# EAGLE design ADXL362WakeOnShake (EAGLE 6.5.0)
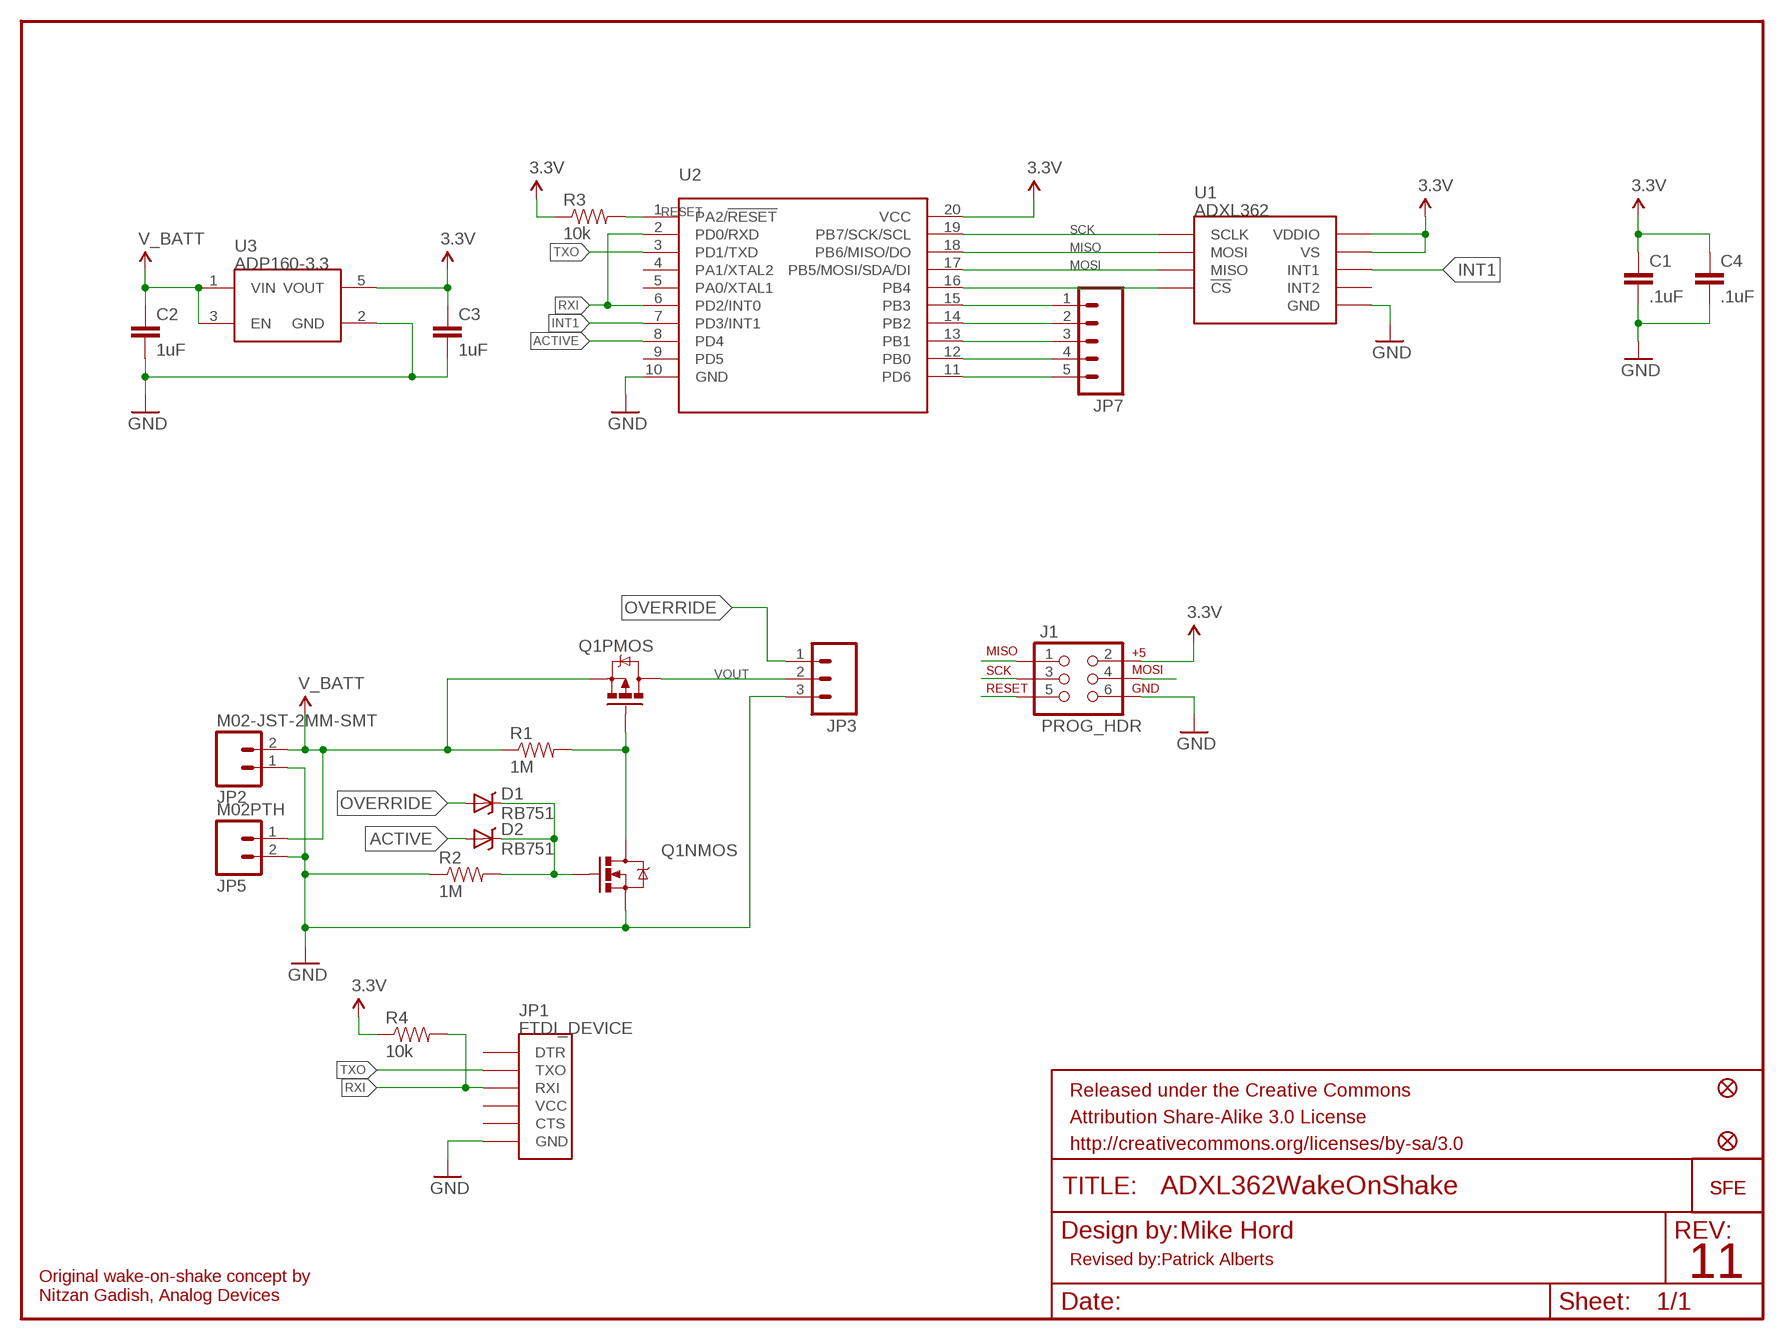
[diagram p0: schematic, sheet 1]

## Parts
C1  .1uF  0.1UF-25V(+80/-20%)(0603)  [0603-CAP]
C2  1uF  1.0UF-16V-10%(0603)  [0603-CAP]
C3  1uF  1.0UF-16V-10%(0603)  [0603-CAP]
C4  .1uF  0.1UF-25V(+80/-20%)(0603)  [0603-CAP]
D1  RB751  [SOD-523]
D2  RB751  DIODE-SCHOTTKY  [SOD-523]
FID1  FIDUCIAL1X2  [FIDUCIAL-1X2]
FID2  FIDUCIAL1X2  [FIDUCIAL-1X2]
FRAME1  FRAME-LETTER  [CREATIVE_COMMONS]
J1  PROG_HDR  AVR_SPI_PRG_6PTH  [2X3]
JP1  FTDI_DEVICE  [FTDI_DEVICE_SIDE]
JP2  M02-JST-2MM-SMT  [JST-2-SMD]
JP3  M03PTH  [1X03]
JP4  LOGO-SFENW2  [SFE-NEW-WEB]
JP5  M02PTH  [1X02]
JP6  LOGO-SFENEW  [SFE-NEW-WEBLOGO]
JP7  M05PTH  [1X05]
Q1  IRF7509  [MSOP8]
R1  1M  1MOHM1/10W1%(0603)  [0603-RES]
R2  1M  1MOHM1/10W1%(0603)  [0603-RES]
R3  10k  10K-1%RES-00824  [0603-RES]
R4  10k  10K-1%RES-00824  [0603-RES]
U1  ADXL362  ADXL362ADXL362-1:1  [ADXL362-1:1]
U2  ATTINY2313A  [SOP20W]
U3  ADP160-3.3  ADP160  [SOT23-5]

## Nets
3.3V: C1.1 C3.1 C4.1 J1.2 R3.1 R4.1 U1.P$1(VDDIO) U1.P$14(VS) U2.20(VCC) U3.5(VOUT)
ACTIVE: D2.A U2.8(PD4)
GND: C1.2 C2.2 C3.2 C4.2 J1.6 JP1.P$6(GND) JP2.1 JP3.3 JP5.2 Q1.1(NMOS:S) R2.1 U1.P$12(GND) U1.P$13(GND) U1.P$16(GND) U2.10(GND) U3.2(GND)
INT1: U1.P$11(INT1) U2.7(PD3/INT1)
MISO: J1.1 U1.P$6(MOSI) U2.18(PB6/MISO/DO)
MOSI: J1.4 U1.P$7(MISO) U2.17(PB5/MOSI/SDA/DI)
N$1: Q1.4(PMOS:G) Q1.7(NMOS:D) Q1.8(NMOS:D) R1.2
N$2: D1.C D2.C Q1.2(NMOS:G) R2.2
N$3: JP7.1 U2.15(PB3)
N$4: JP7.2 U2.14(PB2)
N$5: JP7.3 U2.13(PB1)
N$6: JP7.4 U2.12(PB0)
N$7: U1.P$8(!CS) U2.16(PB4)
N$8: JP7.5 U2.11(PD6)
OVERRIDE: D1.A JP3.1
RESET: J1.5 R3.2 U2.1(PA2/!RESET)
RXI: JP1.P$3(RXI) R4.2 U2.2(PD0/RXD) U2.6(PD2/INT0)
SCK: J1.3 U1.P$4(SCLK) U2.19(PB7/SCK/SCL)
TXO: JP1.P$2(TXO) U2.3(PD1/TXD)
V_BATT: C2.1 JP2.2 JP5.1 Q1.3(PMOS:S) R1.1 U3.1(VIN) U3.3(EN)
VOUT: JP3.2 Q1.5(PMOS:D) Q1.6(PMOS:D)
Unconnected: JP1.P$1(DTR) JP1.P$4(VCC) JP1.P$5(CTS) U1.P$9(INT2) U2.4(PA1/XTAL2) U2.5(PA0/XTAL1) U2.9(PD5)

## Notes on the sheet
- Mike Hord
- Revised by:Patrick Alberts
- 11
- Original wake-on-shake concept by
  Nitzan Gadish, Analog Devices

## Library data of the parts
C1 C4 = SparkFun-Capacitors:0.1UF-25V(+80/-20%)(0603): CAP-00810 Ceramic Standard decoupling cap; PROD_ID: CAP-00810; VALUE: 0.1uF
C2 C3 = SparkFun-Capacitors:1.0UF-16V-10%(0603): CAP-00868; PROD_ID: CAP-00868; VALUE: 1.0uF
D1 = SparkFun-DiscreteSemi:RB751: 40V 120mA SOD-523 Schottky DIO-11018; PROD_ID: DIO-11018
D2 = SparkFun-DiscreteSemi:DIODE-SCHOTTKY: Commonly MBRA140.; PROD_ID: DIO-11018
FID1 FID2 = SparkFun-Aesthetics:FIDUCIAL: Fiducial Alignment Points Various fiducial points for machine vision alignment.
FRAME1 = SparkFun-Aesthetics:FRAME-LETTER: Schematic Frame Standard 8.5x11 US Letter frame
J1 = SparkFun-Connectors:AVR_SPI_PRG_6: AVR ISP 6 Pin This is the reduced ISP connector for AVR programming. Common on Arduino. This footprint will take up less PCB space and can be used with a 10-pin to 6-pin adapter such as SKU: BOB-08508
JP1 = SparkFun-Connectors:FTDI_DEVICE: Connector which mates to FTDI basic or FTDI cable.
JP2 = SparkFun-Connectors:M02: Standard 2-pin 0.1" header. Use with - straight break away headers ( PRT-00116) - right angle break away headers (PRT-00553) - swiss pins (PRT-00743) - machine pins (PRT-00117) - female headers (PRT-00115) Molex polarized connector foot print use with: PRT-08233 with associated crimp pins and housings. 2.54_SCREWTERM for use with PRT-10571. 3.5mm Screw Terminal footprints for PRT-08084 5mm Screw Terminal footprints for use with PRT-08433; PROD_ID: CONN-08352
JP3 = SparkFun-Connectors:M03: Header 3 Standard 3-pin 0.1" header. Use with straight break away headers (SKU : PRT-00116), right angle break away headers (PRT-00553), swiss pins (PRT-00743), machine pins (PRT-00117), and female headers (PRT-00115). Molex polarized connector foot print use with SKU : PRT-08232 with associated crimp pins and housings.
JP4 JP6 = SparkFun-Aesthetics:LOGO-SFE: Spark Fun Electronics PCB Logo This is the standard Spark Fun Electronics PCB logo.
JP5 = SparkFun-Connectors:M02: Standard 2-pin 0.1" header. Use with - straight break away headers ( PRT-00116) - right angle break away headers (PRT-00553) - swiss pins (PRT-00743) - machine pins (PRT-00117) - female headers (PRT-00115) Molex polarized connector foot print use with: PRT-08233 with associated crimp pins and housings. 2.54_SCREWTERM for use with PRT-10571. 3.5mm Screw Terminal footprints for PRT-08084 5mm Screw Terminal footprints for use with PRT-08433
JP7 = SparkFun-Connectors:M05: Header 5 Standard 5-pin 0.1" header. Use with straight break away headers (SKU : PRT-00116), right angle break away headers (PRT-00553), swiss pins (PRT-00743), machine pins (PRT-00117), and female headers (PRT-00115). Molex polarized connector foot print use with SKU : PRT-08230 with associated crimp pins and housings.
Q1 = SparkFun-DiscreteSemi:IRF7509: 30V Dual PMOS/NMOS MSOP-8 NMOS RDS .11-ohm PMOS RDS .20-ohm; PROD_ID: TRANS-07913
R1 R2 = SparkFun-Resistors:1MOHM1/10W1%(0603): RES-07868; PROD_ID: RES-07868
R3 R4 = SparkFun-Resistors:10K-1%: 10k-ohm SMT 1/10W - 1% (0603) RES-00824; PROD_ID: RES-00824
U1 = SparkFun-Sensors:ADXL362: Micropower 3-axis accelerometer 2/4/8g digital output (SPI) IC-11297
U2 = SparkFun-DigitalIC:ATTINY2313A: ATTINY2313A 2kB 20MHz I2C/SPI/UART; DIST: DIGIKEY; DIST_ID: ATTINY2313A-SU-ND; PROD_ID: IC-11305; VALUE: ATTINY2313A
U3 = SparkFun-PowerIC:ADP160: Nanopower LDO Iq less than 1uA for low Iload; DIST: Digikey; DIST_ID: ADP160AUJZ-3.3-R7TR-ND; PROD_ID: VREG-11306; VALUE: ADP160

## Board
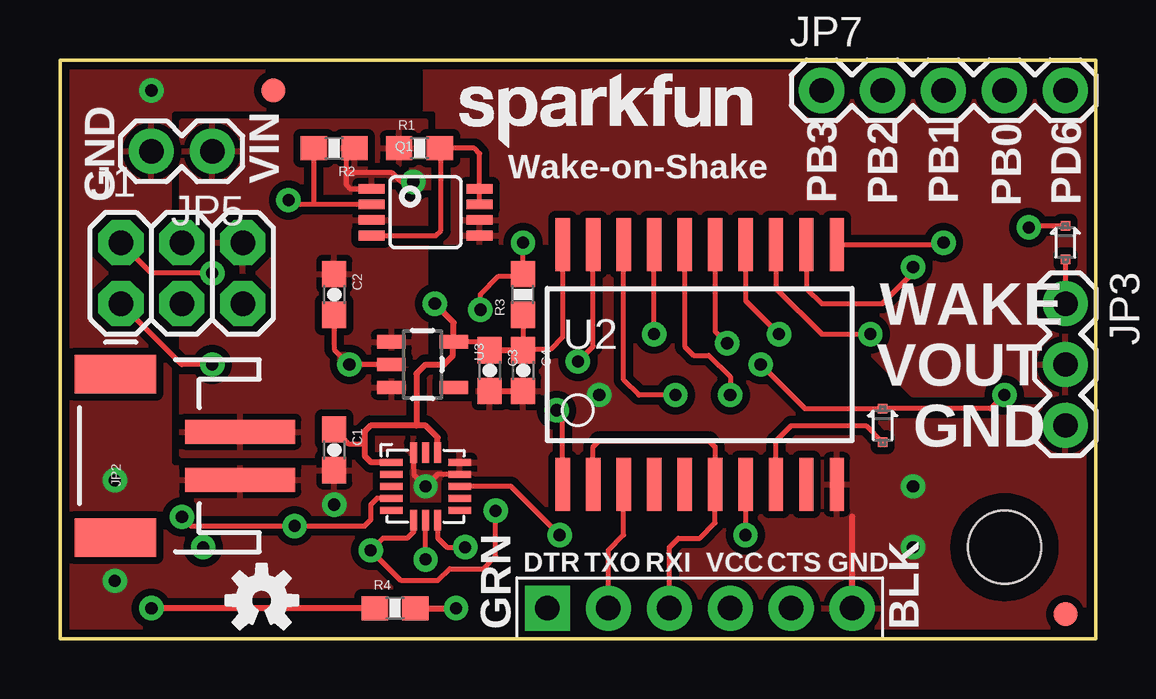
[diagram p1: board, top side]
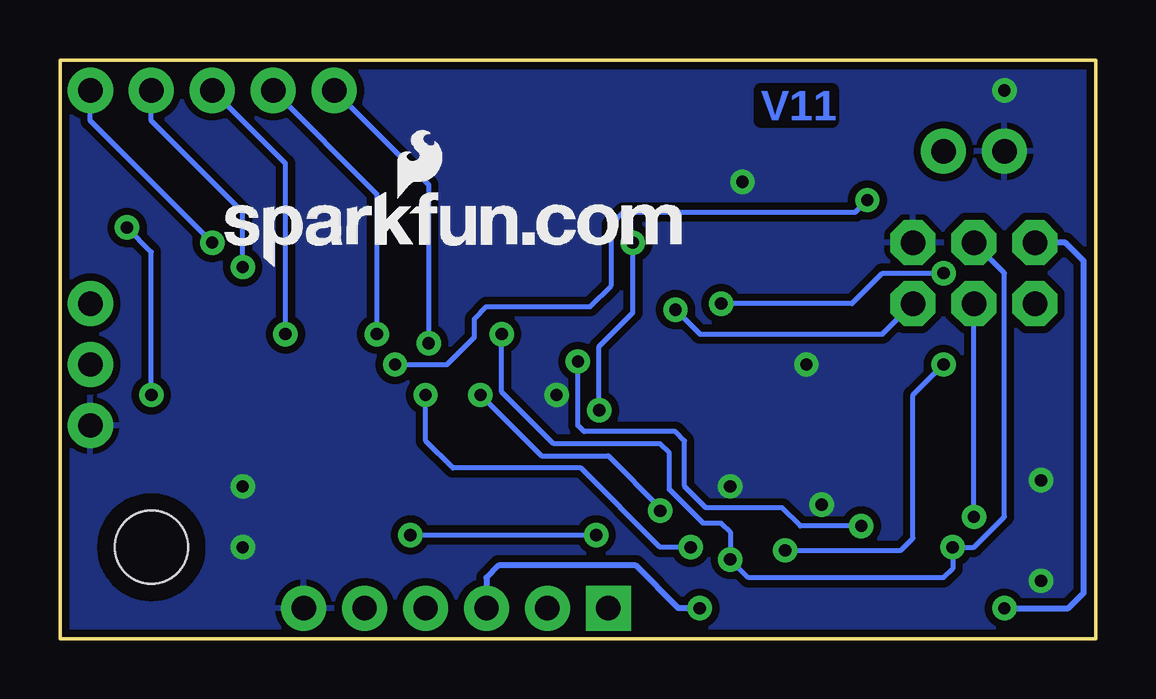
[diagram p2: board, bottom side, seen from below]

Size 43.18 x 24.13 mm. Coordinates in mm from the lower left corner, seen from the top.
Outline: 0,0 43.18,0 43.18,24.13 0,24.13 0,0
Copper layers (1*16): Top 0.035mm / dielectric 1.5mm / Bottom 0.035mm
Design rules "SparkFun-2-layer": minimum track width 7mil, minimum drill 15mil, track to track 8mil, track to pad 8mil, pad to pad 8mil, via to via 8mil, smd to smd 8mil, copper to edge 8mil, drill to drill 8mil, minimum pad ring 12mil, minimum via ring 10mil, stop-mask expansion 4mil, vias tented up to drill 20mil, thermal gap 10mil

### Footprints (pad centres in the part's own frame; a part is rotated, then mirrored left to right if it is on the bottom)
0603-CAP = smd 1.1 x 1: 1 -0.85,0; 2 0.85,0
SOD-523 = smd 0.4 x 0.4: A -0.7,0; C 0.7,0
FIDUCIAL-1X2 = smd 1 x 1: 1 0,0
2X3 = drill 1.016 pad 1.88 octagon: 1 0,0; 2 0,2.54; 3 2.54,0; 4 2.54,2.54; 5 5.08,0; 6 5.08,2.54
FTDI_DEVICE_SIDE = drill 1.016 pad 1.88 square: P$1 -6.35,0 | drill 1.016 pad 1.88: P$2 -3.81,0; P$3 -1.27,0; P$4 1.27,0; P$5 3.81,0; P$6 6.35,0
JST-2-SMD = smd 1 x 4.6: 1 -1,-3.7; 2 1,-3.7 | smd 1.6 x 3.4: NC1 -3.4,1.5; NC2 3.4,1.5
1X03 = drill 1.016 pad 1.88: 1 0,0; 2 2.54,0; 3 5.08,0
1X02 = drill 1.016 pad 1.88: 1 0,0; 2 2.54,0
1X05 = drill 1.016 pad 1.88: 1 0,0; 2 2.54,0; 3 5.08,0; 4 7.62,0; 5 10.16,0
MSOP8 = smd 0.4 x 1.1: 1 -0.975,-2.25; 2 -0.325,-2.25; 3 0.325,-2.25; 4 0.975,-2.25; 5 0.975,2.25; 6 0.325,2.25; 7 -0.325,2.25; 8 -0.975,2.25
0603-RES = smd 1.1 x 1: 1 -0.85,0; 2 0.85,0
ADXL362-1:1 = smd 0.952 x 0.3: P$1 -1.426,1; P$2 -1.426,0.5; P$3 -1.426,0; P$4 -1.426,-0.5; P$5 -1.426,-1; P$9 1.426,-1; P$10 1.426,-0.5; P$11 1.426,0; P$12 1.426,0.5; P$13 1.426,1 | smd 0.3 x 0.851: P$6 -0.5,-1.402; P$7 0,-1.402; P$8 0.5,-1.402; P$14 0.5,1.402; P$15 0,1.402; P$16 -0.5,1.402
SOP20W = smd 0.6 x 2.2: 1 -5.715,-5; 2 -4.445,-5; 3 -3.175,-5; 4 -1.905,-5; 5 -0.635,-5; 6 0.635,-5; 7 1.905,-5; 8 3.175,-5; 9 4.445,-5; 10 5.715,-5; 11 5.715,5; 12 4.445,5; 13 3.175,5; 14 1.905,5; 15 0.635,5; 16 -0.635,5; 17 -1.905,5; 18 -3.175,5; 19 -4.445,5; 20 -5.715,5
SOT23-5 = smd 0.55 x 1.2: 1 -0.95,-1.3; 2 0,-1.3; 3 0.95,-1.3; 4 0.95,1.3; 5 -0.95,1.3
STAND-OFF-TIGHT = hole 3.048: 0,0

### Placement (x,y rotation side)
C1  11.43,7.87 270 top
C2  11.43,14.35 270 top
C3  17.91,11.18 270 top
C4  19.3,11.18 270 top
D1  41.91,16.51 90 top
D2  34.29,8.89 90 top
FID1  41.91,1.02 0 top
FID2  8.89,22.86 0 top
FRAME1  -77.47,21.59 0 top  (outside the outline)
J1  2.54,13.97 0 top
JP1  26.67,1.27 0 top
JP2  3.81,7.62 90 top
JP3  41.91,13.97 270 top
JP4  16.64,20.45 0 top
JP5  6.35,20.32 180 top
JP6  36.32,15.49 0 bottom
JP7  31.75,22.86 0 top
Q1  15.24,17.78 270 top
R1  14.99,20.45 0 top
R2  11.43,20.45 180 top
R3  19.3,14.35 90 top
R4  13.97,1.27 0 top
U1  15.24,6.35 0 top
U2  26.67,11.43 0 top
U3  15.11,11.43 270 top
U$3  [OSHW-LOGO-S]  8.41,1.6 0 top
U$4  [STAND-OFF-TIGHT]  39.37,3.81 0 top

### Tracks (layer width: path | path; a pad name or v marks a point on that pad's centre or on a via)
3.3V  (via drill 0.51)
  Top 0.203: R3.1 C4.1 19.34,12.06 20.45,12.06 20.95,12.57 U2.20 | v6.35,15.24 3.81,15.24 J1.2 | C1.1 12.03,8.13 12.7,8.13 | C3.1 17.55,12.38 U3.5 16.51,12.28
  Top 0.254: C3.1 C4.1 | U1.P$1 12.97,7.35 12.7,7.62 12.7,8.13 12.7,8.64 12.95,8.89 14.86,8.89 | R4.1 v3.81,1.27 | U1.P$14 15.74,8.39 15.24,8.89 14.86,8.89 | 14.86,8.89 14.86,11.05 15.24,11.43 16,11.43 16.38,11.81 16.38,12.35 U3.5 16.41,13.18 v15.62,13.97
  Bottom 0.203: v15.62,13.97 10.16,13.97 8.89,15.24 v6.35,15.24
  Bottom 0.254: v3.81,1.27 1.14,1.27 0.51,1.91 0.51,15.75 1.27,16.51 J1.2
ACTIVE
  Top 0.203: U2.8 29.84,8.26 30.48,8.89 33.59,8.89 D2.A
GND  (via drill 0.51)
  Top 0.203: U1.P$16 14.74,6.85 v15.24,6.35 15.74,6.85 U1.P$12 | Q1.1 12.11,18.75 11.94,18.92 11.94,19.43 | 11.94,19.43 11.94,20.11 R2.1 | v14.73,19.05 14.22,19.05 13.84,19.43 11.94,19.43 | U3.2 v12.06,11.43 11.43,12.06 C2.2
  Top 0.254: U2.10 32.38,5.71 | 33.02,5.08 JP1.P$6 | C3.2 C4.2
  other vias: 11.43,5.59 22.48,10.16 2.29,6.6 2.29,2.41 35.56,6.35 35.56,3.81 3.81,22.86
  pour Bottom (isolate 0.305, rank 6): 0,24.13 43.18,24.13 43.18,0 0,0
  pour Top (isolate 0.305, rank 6): 0,24.13 43.18,24.13 43.18,0 0,0
INT1  (via drill 0.51)
  Top 0.203: U2.7 v28.57,4.32 | v20.83,4.32 18.8,6.35 U1.P$11
  Bottom 0.203: v28.57,4.32 v20.83,4.32
MISO  (via drill 0.51)
  Top 0.203: v18.16,5.33 18.16,3.43 17.65,2.92 16.26,2.92 15.75,2.41 14.22,2.41 v12.95,3.68 13.46,4.19 14.48,4.19 14.74,4.45 U1.P$6 | v25.65,10.16 24.13,10.16 23.5,10.79 U2.18 | v6.35,11.43 5.08,11.43 J1.1
  Bottom 0.203: v12.95,3.68 8.13,3.68 7.62,4.19 7.62,10.16 v6.35,11.43 | v25.65,10.16 23.11,7.62 20.32,7.62 18.16,5.46 v18.16,5.33
MOSI  (via drill 0.51)
  Top 0.203: v24.77,12.7 U2.17 | 15.24,5.08 U1.P$7 v15.24,3.3
  Bottom 0.203: v24.77,12.7 24.77,10.29 22.61,8.13 18.16,8.13 17.78,7.75 17.78,6.22 16.38,4.83 15.62,4.83 15.24,4.45 v15.24,3.3 14.48,2.54 6.35,2.54 5.97,2.92 v5.97,3.81 5.08,3.81 3.81,5.08 3.81,15.24 J1.4
N$1
  Top 0.203: Q1.7 Q1.8 17.49,20.23 17.27,20.45 R1.2 15.88,20.41 15.88,17.02 15.66,16.8 Q1.4
N$2  (via drill 0.51)
  Top 0.203: Q1.2 10.58,18.11 | 10.58,18.11 9.71,18.11 | R2.2 10.58,18.11 | v40.39,17.14 40.45,17.21 D1.C | v29.21,11.43 31.05,9.59 D2.C 38.8,9.59 v39.37,10.16
  Top 0.254: 9.71,18.11 v9.53,18.29
  Bottom 0.203: v39.37,10.16 39.37,16.13 v40.39,17.14 | v29.21,11.43 27.05,11.43 25.91,12.57 25.91,13.34 25.4,13.84 21.08,13.84 20.19,14.73 20.19,17.27 19.68,17.78 10.03,17.78 v9.53,18.29
N$3  (via drill 0.51)
  Top 0.203: U2.15 27.3,12.83 v27.81,12.32
  Bottom 0.203: JP7.1 27.81,18.92 v27.81,12.32
N$4  (via drill 0.51)
  Top 0.203: U2.14 28.57,14.1 v29.97,12.7
  Bottom 0.203: JP7.2 29.97,18.54 v29.97,12.7
N$5  (via drill 0.51)
  Top 0.203: U2.13 29.84,14.61 31.75,12.7 v33.78,12.7
  Bottom 0.203: v33.78,12.7 33.78,19.81 JP7.3
N$6  (via drill 0.51)
  Top 0.203: U2.12 31.11,14.61 31.75,13.97 34.29,13.97 35.56,15.24 v35.56,15.49
  Bottom 0.203: v35.56,15.49 35.56,17.78 39.37,21.59 JP7.4
N$7  (via drill 0.51)
  Top 0.203: U1.P$8 15.74,4.2 16.13,3.81 v16.89,3.81 | U2.16 26.04,12.19 26.42,11.81 27.05,11.81 27.94,10.92 v27.94,10.16
  Bottom 0.203: v16.89,3.81 18.16,3.81 21.46,7.11 26.8,7.11 27.94,8.26 v27.94,10.16
N$8  (via drill 0.51)
  Top 0.203: U2.11 36.75,16.43 v36.83,16.51
  Bottom 0.203: v36.83,16.51 41.91,21.59 JP7.5
OVERRIDE
  Top 0.203: D1.A JP3.1
RESET  (via drill 0.51)
  Top 0.203: v19.3,16.51 R3.2 19.22,15.11 18.29,15.11 17.53,14.35 v17.53,13.72 | U2.1 20.95,9.27 v20.7,9.53
  Bottom 0.203: v17.53,13.72 16.51,12.7 8.89,12.7 J1.5 | v20.7,9.53 20.7,12.19 19.3,13.59 v19.3,16.51
RXI  (via drill 0.51)
  Top 0.203: JP1.P$3 25.4,3.81 25.78,4.19 26.67,4.19 27.3,4.83 U2.6 27.3,8 27.05,8.26 22.48,8.26 22.23,8 U2.2
  Top 0.254: U2.6 27.3,5.71 | R4.2 v16.51,1.27
  Bottom 0.254: v16.51,1.27 17.4,1.27 19.18,3.05 24.89,3.05 25.4,2.54 JP1.P$3
SCK  (via drill 0.51)
  Top 0.203: U1.P$4 13.22,5.85 12.95,5.59 12.95,4.95 12.7,4.7 v9.78,4.7 5.46,4.7 v5.08,5.08 | v21.59,11.56 22.23,12.19 U2.19
  Bottom 0.203: v9.78,4.7 12.32,4.7 13.08,5.46 16.26,5.46 17.14,6.35 17.14,8.26 17.53,8.64 21.34,8.64 21.59,8.89 v21.59,11.56 | v5.08,5.08 J1.3
TXO
  Top 0.203: JP1.P$2 22.86,3.68 23.5,4.32 U2.3
V_BATT
  pour Top (isolate 0.305): 15.24,21.59 15.24,7.62 5.08,7.62 5.08,21.59
VOUT
  pour Top (isolate 0.305, rank 2): 15.24,24.13 43.18,24.13 43.18,10.16 35.56,10.16 29.21,16.51 15.24,16.51

### Text on the board
Bottom: V11
tPlace: GND | VIN | Wake-on-Shake | PB3 | PB2 | PB1 | PB0 | PD6 | WAKE | VOUT | GND
tValues: M. Hord | Original wake-on-shake concept by / Nitzan Gadish, Analog Devices